# EAGLE design EXT_TWI_LVC (EAGLE 6.5.0)
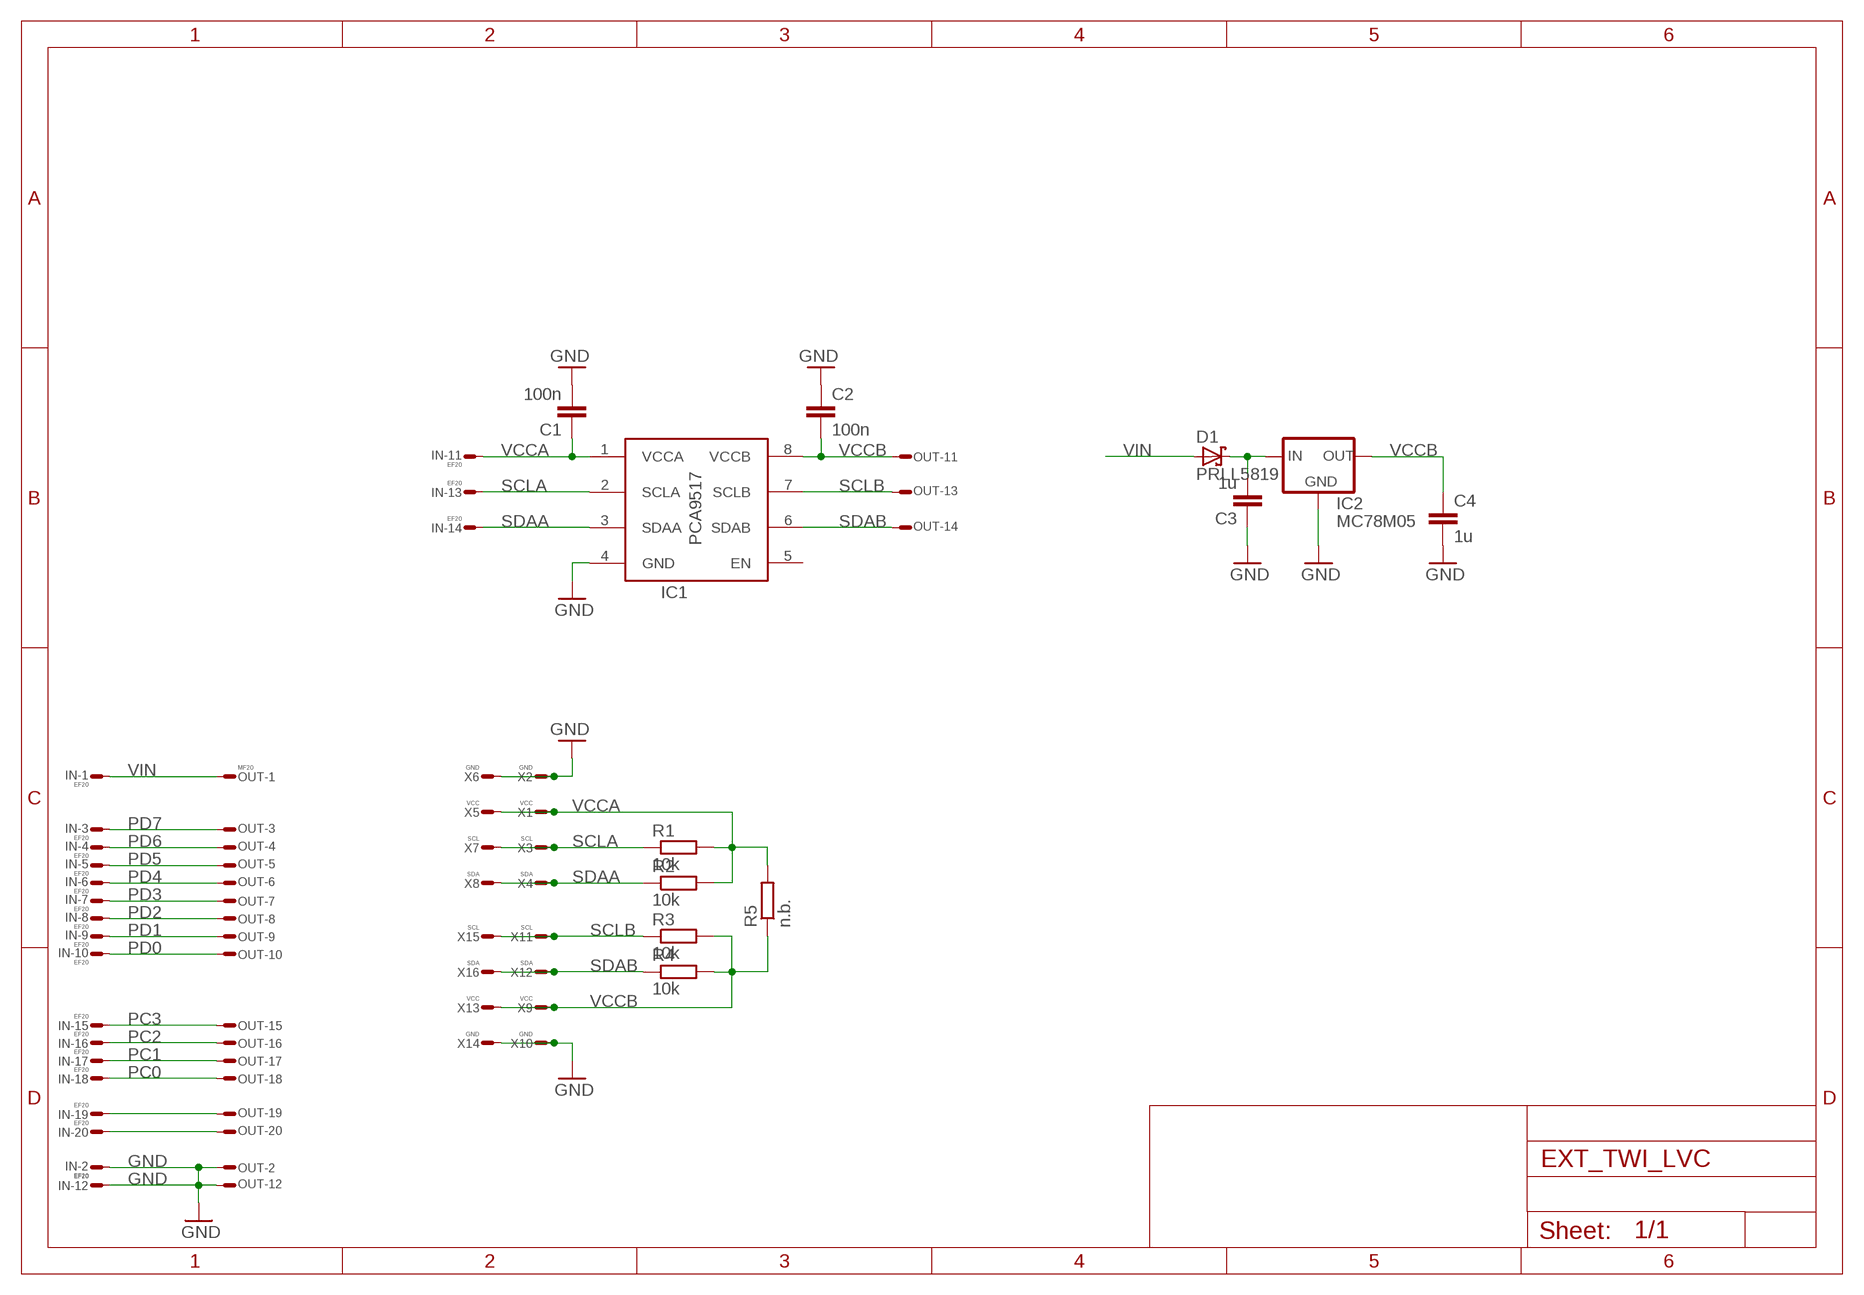
[diagram p0: schematic, sheet 1]

## Parts
C1  100n  C0603  [0603]
C2  100n  C0603  [0603]
C3  1u  C1206  [1206]
C4  1u  C1206  [1206]
D1  PRLL5819  D-SCHOTKY7  [SOD87]
IC1  PCA9517  PCA9517D  [SOIC8]
IC2  MC78M05  78XXD  [DPAK]
IN  EF20  FE20ELSS  [FE10-2WSS]
OUT  MF20  ML20LSE  [ML20LS]
R1  10k  R0603  [0603]
R2  10k  R0603  [0603]
R3  10k  R0603  [0603]
R4  10k  R0603  [0603]
R5  n.b.  R1206  [1206]
X1  VCC  WIREPADT1.6/0.9  [T1.6/0.9]
X2  GND  WIREPADT1.6/0.9  [T1.6/0.9]
X3  SCL  WIREPADT1.6/0.9  [T1.6/0.9]
X4  SDA  WIREPADT1.6/0.9  [T1.6/0.9]
X5  VCC  WIREPADT1.6/0.9  [T1.6/0.9]
X6  GND  WIREPADT1.6/0.9  [T1.6/0.9]
X7  SCL  WIREPADT1.6/0.9  [T1.6/0.9]
X8  SDA  WIREPADT1.6/0.9  [T1.6/0.9]
X9  VCC  WIREPADT1.6/0.9  [T1.6/0.9]
X10  GND  WIREPADT1.6/0.9  [T1.6/0.9]
X11  SCL  WIREPADT1.6/0.9  [T1.6/0.9]
X12  SDA  WIREPADT1.6/0.9  [T1.6/0.9]
X13  VCC  WIREPADT1.6/0.9  [T1.6/0.9]
X14  GND  WIREPADT1.6/0.9  [T1.6/0.9]
X15  SCL  WIREPADT1.6/0.9  [T1.6/0.9]
X16  SDA  WIREPADT1.6/0.9  [T1.6/0.9]

## Nets
GND: C1.2 C2.1 C3.1 C4.2 IC1.4(GND) IC2.4(GND) IN.P$2 IN.P$12 OUT.P$2 OUT.P$12 X2.1(S) X6.1(S) X10.1(S) X14.1(S)
N$1: IN.P$20 OUT.P$20
N$2: C3.2 D1.C IC2.1(IN)
N$3: IN.P$19 OUT.P$19
PC0: IN.P$18 OUT.P$18
PC1: IN.P$17 OUT.P$17
PC2: IN.P$16 OUT.P$16
PC3: IN.P$15 OUT.P$15
PD0: IN.P$10 OUT.P$10
PD1: IN.P$9 OUT.P$9
PD2: IN.P$8 OUT.P$8
PD3: IN.P$7 OUT.P$7
PD4: IN.P$6 OUT.P$6
PD5: IN.P$5 OUT.P$5
PD6: IN.P$4 OUT.P$4
PD7: IN.P$3 OUT.P$3
SCLA: IC1.2(SCLA) IN.P$13 R1.1 X3.1(S) X7.1(S)
SCLB: IC1.7(SCLB) OUT.P$13 R3.1 X11.1(S) X15.1(S)
SDAA: IC1.3(SDAA) IN.P$14 R2.1 X4.1(S) X8.1(S)
SDAB: IC1.6(SDAB) OUT.P$14 R4.1 X12.1(S) X16.1(S)
VCCA: C1.1 IC1.1(VCCA) IN.P$11 R1.2 R2.2 R5.2 X1.1(S) X5.1(S)
VCCB: C2.2 C4.1 IC1.8(VCCB) IC2.3(OUT) OUT.P$11 R3.2 R4.2 R5.1 X9.1(S) X13.1(S)
VIN: D1.A IN.P$1 OUT.P$1
Unconnected: IC1.5(EN)

## Library data of the parts
C1-C4 = RCL:C: Capacitor SMD
D1 = Diode:D-SCHOTKY: Schottky Diode
IC1 = Other:PCA9517
IC2 = DCDC:78XX: Voltage Regulator
IN = Conn:FE20E
OUT = Conn:ML20?E: HARTING
R1-R5 = RCL:R: Resistor SMD
X1-X16 = Conn:WIREPAD: Wire PAD connect wire on PCB

## Board
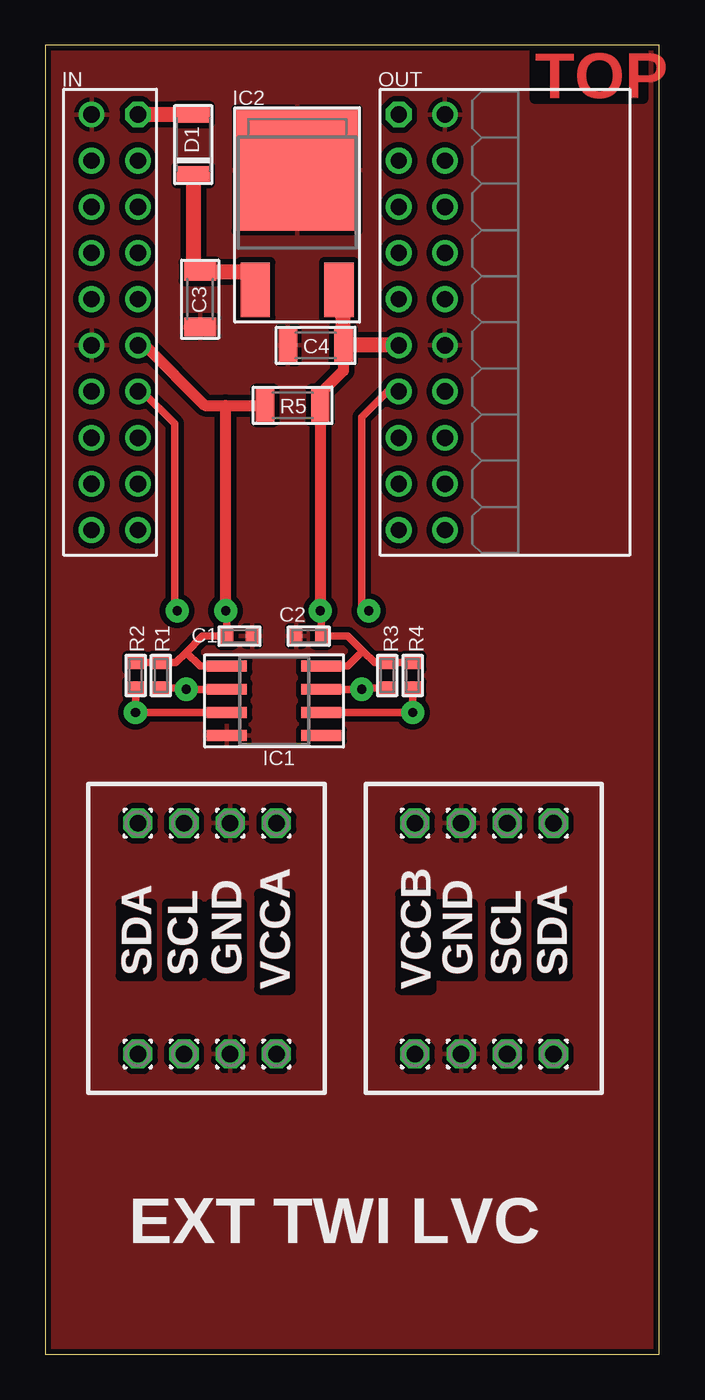
[diagram p1: board, top side]
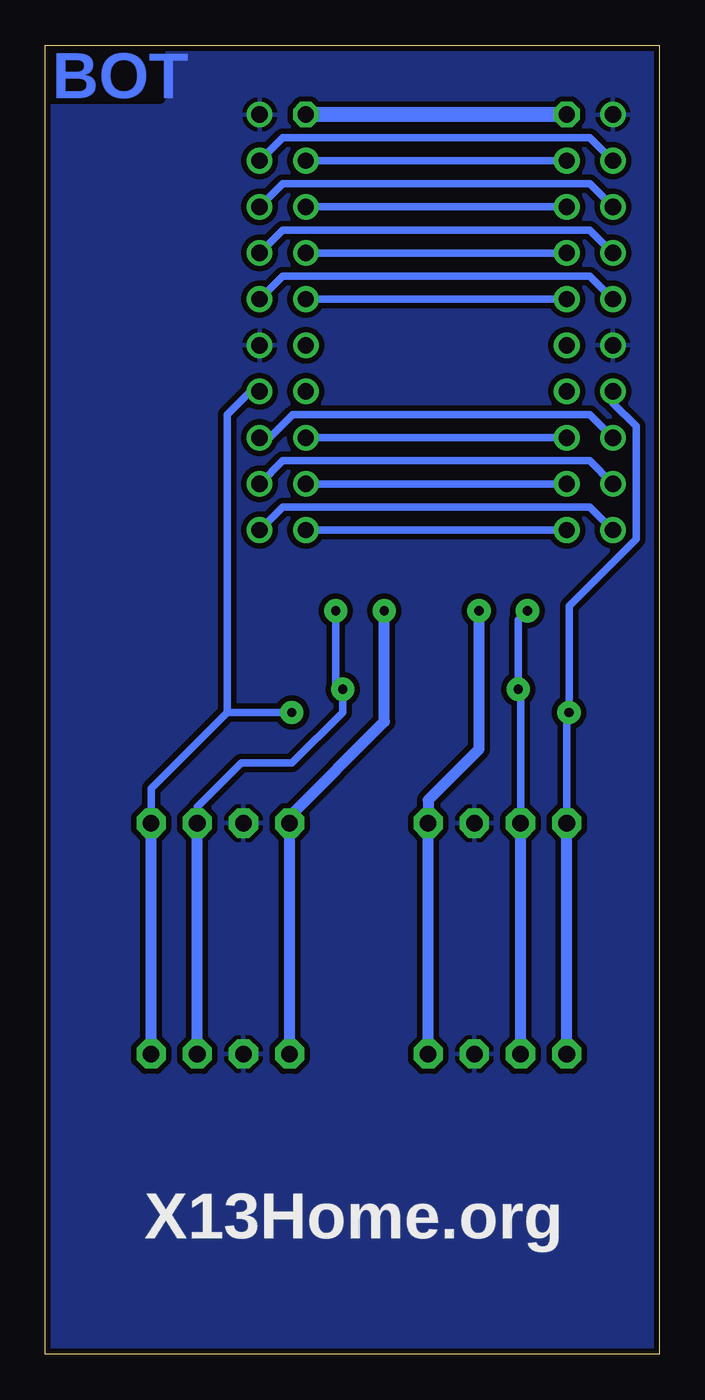
[diagram p2: board, bottom side, seen from below]

Size 33.75 x 72 mm. Coordinates in mm from the lower left corner, seen from the top.
Outline: 0,0 33.75,0 33.75,72 0,72 0,0
Copper layers (1*16): Top 0.035mm / dielectric 1.5mm / Bottom 0.035mm
Design rules "default *": minimum track width 10mil, minimum drill 10mil, track to track 12mil, track to pad 12mil, pad to pad 12mil, via to via 12mil, smd to smd 12mil, copper to edge 12mil, drill to drill 8mil, minimum pad ring 10mil, minimum via ring 8mil, stop-mask expansion 4mil, vias tented up to drill 0mil, thermal gap 10mil
tKeepout: area 0,0 to 33.8,2; area 0,70 to 33.8,72

### Footprints (pad centres in the part's own frame; a part is rotated, then mirrored left to right if it is on the bottom)
0603 = smd 0.7 x 0.9: 1 -0.697,0; 2 0.697,0
1206 = smd 1.016 x 1.778: 1 -1.524,0; 2 1.524,0
SOD87 = smd 0.9 x 1.8: A 1.65,0; C -1.65,0
SOIC8 = smd 0.6 x 2.2: 1 -1.905,-2.6; 2 -0.635,-2.6; 3 0.635,-2.6; 4 1.905,-2.6; 5 1.905,2.6; 6 0.635,2.6; 7 -0.635,2.6; 8 -1.905,2.6
DPAK = smd 1.6 x 3: 1 -2.3,-3.3; 3 2.3,-3.3 | smd 6.7 x 6.7: 4 0,3.3
FE10-2WSS = drill 0.9 octagon: P$1 -11.43,1.27 | drill 0.9: P$2 -11.43,-1.27; P$3 -8.89,1.27; P$4 -8.89,-1.27; P$5 -6.35,1.27; P$6 -6.35,-1.27; P$7 -3.81,1.27; P$8 -3.81,-1.27; P$9 -1.27,1.27; P$10 -1.27,-1.27; P$11 1.27,1.27; P$12 1.27,-1.27; P$13 3.81,1.27; P$14 3.81,-1.27; P$15 6.35,1.27; P$16 6.35,-1.27; P$17 8.89,1.27; P$18 8.89,-1.27; P$19 11.43,1.27; P$20 11.43,-1.27
ML20LS = drill 0.9 octagon: P$1 -11.43,-1.27 | drill 0.9: P$2 -11.43,1.27; P$3 -8.89,-1.27; P$4 -8.89,1.27; P$5 -6.35,-1.27; P$6 -6.35,1.27; P$7 -3.81,-1.27; P$8 -3.81,1.27; P$9 -1.27,-1.27; P$10 -1.27,1.27; P$11 1.27,-1.27; P$12 1.27,1.27; P$13 3.81,-1.27; P$14 3.81,1.27; P$15 6.35,-1.27; P$16 6.35,1.27; P$17 8.89,-1.27; P$18 8.89,1.27; P$19 11.43,-1.27; P$20 11.43,1.27
T1.6/0.9 = drill 0.914 pad 1.6 octagon: 1 0,0

### Placement (x,y rotation side)
C1  10.67,39.5 0 top
C2  14.48,39.5 0 top
C3  8.51,58.04 90 top
C4  14.86,55.5 180 top
D1  8.13,66.55 90 top
IC1  12.57,35.94 270 top
IC2  13.84,61.85 0 top
IN  3.81,56.77 270 top
OUT  20.7,56.77 270 top
R1  6.35,37.34 90 top
R2  4.95,37.34 90 top
R3  18.8,37.34 90 top
R4  20.19,37.34 90 top
R5  13.59,52.2 180 top
X1  12.7,29.21 270 top
X2  10.16,29.21 270 top
X3  7.62,29.21 270 top
X4  5.08,29.21 270 top
X5  12.7,16.51 90 top
X6  10.16,16.51 90 top
X7  7.62,16.51 90 top
X8  5.08,16.51 90 top
X9  20.32,29.21 270 top
X10  22.86,29.21 270 top
X11  25.4,29.21 270 top
X12  27.94,29.21 270 top
X13  20.32,16.51 90 top
X14  22.86,16.51 90 top
X15  25.4,16.51 90 top
X16  27.94,16.51 90 top

### Tracks (layer width: path | path; a pad name or v marks a point on that pad's centre or on a via)
GND
  pour Bottom: 0,0.13 33.66,0.13 33.66,71.88 0,71.88
  pour Top: 0,0 33.66,0 33.66,71.88 0,71.88
N$1
  Bottom 0.406: IN.P$20 3.81,46.61 20.7,46.61 OUT.P$20
N$2
  Top 0.813: IC2.1 11.3,58.56 11.3,59.31 11.05,59.56 C3.2 8.13,59.56 D1.C
N$3
  Bottom 0.406: IN.P$19 OUT.P$19
PC0
  Bottom 0.406: IN.P$18 3.81,49.15 20.7,49.15 OUT.P$18
PC1
  Bottom 0.406: IN.P$17 OUT.P$17
PC2
  Bottom 0.406: OUT.P$16 21.41,50.42 20.14,51.69 3.81,51.69 IN.P$16
PC3
  Bottom 0.406: IN.P$15 OUT.P$15
PD0
  Bottom 0.406: IN.P$10 3.81,59.31 20.7,59.31 OUT.P$10
PD1
  Bottom 0.406: IN.P$9 OUT.P$9
PD2
  Bottom 0.406: IN.P$8 3.81,61.85 20.7,61.85 OUT.P$8
PD3
  Bottom 0.406: IN.P$7 OUT.P$7
PD4
  Bottom 0.406: IN.P$6 3.81,64.39 20.7,64.39 OUT.P$6
PD5
  Bottom 0.406: IN.P$5 OUT.P$5
PD6
  Bottom 0.406: IN.P$4 3.81,66.93 20.7,66.93 OUT.P$4
PD7
  Bottom 0.406: IN.P$3 OUT.P$3
SCLA  (via drill 0.5 pad 1.27)
  Top 0.406: IC1.2 v7.75,36.58 7.68,36.64 R1.1 | IN.P$13 5.33,52.96 7.11,51.18 7.11,41.02 v7.24,40.89
  Bottom 0.406: X3.1 7.62,36.45 v7.75,36.58 7.75,40.39 v7.24,40.89
  Bottom 0.61: X7.1 X3.1
SCLB  (via drill 0.5 pad 1.27)
  Top 0.406: IC1.7 v17.4,36.58 17.46,36.64 R3.1 | OUT.P$13 18.8,52.96 17.4,51.56 17.4,41.27 v17.78,40.89
  Bottom 0.406: v17.78,40.89 17.78,36.96 v17.4,36.58 17.4,35.31 20.19,32.51 22.99,32.51 25.4,30.1 X11.1
  Bottom 0.61: X15.1 X11.1
SDAA  (via drill 0.5 pad 1.27)
  Top 0.406: IC1.3 v4.95,35.31 R2.1
  Bottom 0.406: IN.P$14 2.54,52.32 1.27,51.05 1.27,44.83 4.95,41.15 v4.95,35.31 5.08,35.18 X4.1
  Bottom 0.61: X8.1 X4.1
SDAB  (via drill 0.5 pad 1.27)
  Top 0.406: IC1.6 v20.19,35.31 R4.1
  Bottom 0.406: 23.75,35.31 23.75,51.69 22.48,52.96 OUT.P$14 | X12.1 27.94,31.11 23.75,35.31 | 23.75,35.31 v20.19,35.31
  Bottom 0.61: X16.1 X12.1
VCCA  (via drill 0.5 pad 1.27)
  Top 0.406: R2.2 R1.2 7.17,38.03 7.75,38.61 | C1.1 9.97,40.83 v9.91,40.89 | 7.75,38.61 8.64,39.5 C1.1 | C1.1 | IC1.1 8.51,37.85 7.75,38.61
  Top 0.61: IN.P$11 5.46,55.5 8.76,52.2 9.91,52.2 | 9.91,52.2 R5.2 | v9.91,40.89 9.91,52.2
  Bottom 0.61: v9.91,40.89 9.91,33.27 12.7,30.48 X1.1 X5.1
VCCB  (via drill 0.5 pad 1.27)
  Top 0.406: R4.2 R3.2 18.1,38.03 17.46,38.67 | C2.2 15.18,40.83 v15.11,40.89 | 17.46,38.67 16.64,39.5 C2.2 | C2.2 | IC1.8 16.64,37.85 17.46,38.67
  Top 0.61: C4.1 16.38,54.1 15.11,52.83 R5.1 v15.11,40.89
  Top 0.813: OUT.P$11 C4.1 16.38,57.15 15.88,57.66 15.88,58.55 15.89,58.55 IC2.3
  Bottom 0.61: v15.11,40.89 15.11,34.8 20.32,29.59 X9.1 X13.1
VIN
  Top 0.813: D1.A IN.P$1
  Bottom 0.813: IN.P$1 OUT.P$1

### Text on the board
Top: TOP | SDA | SCL | GND | GND | SCL | SDA | VCCA | VCCB
Bottom: BOT
tNames: SDA | SCL | GND | GND | SCL | SDA | VCCA | VCCB | EXT TWI LVC
bNames: X13Home.org